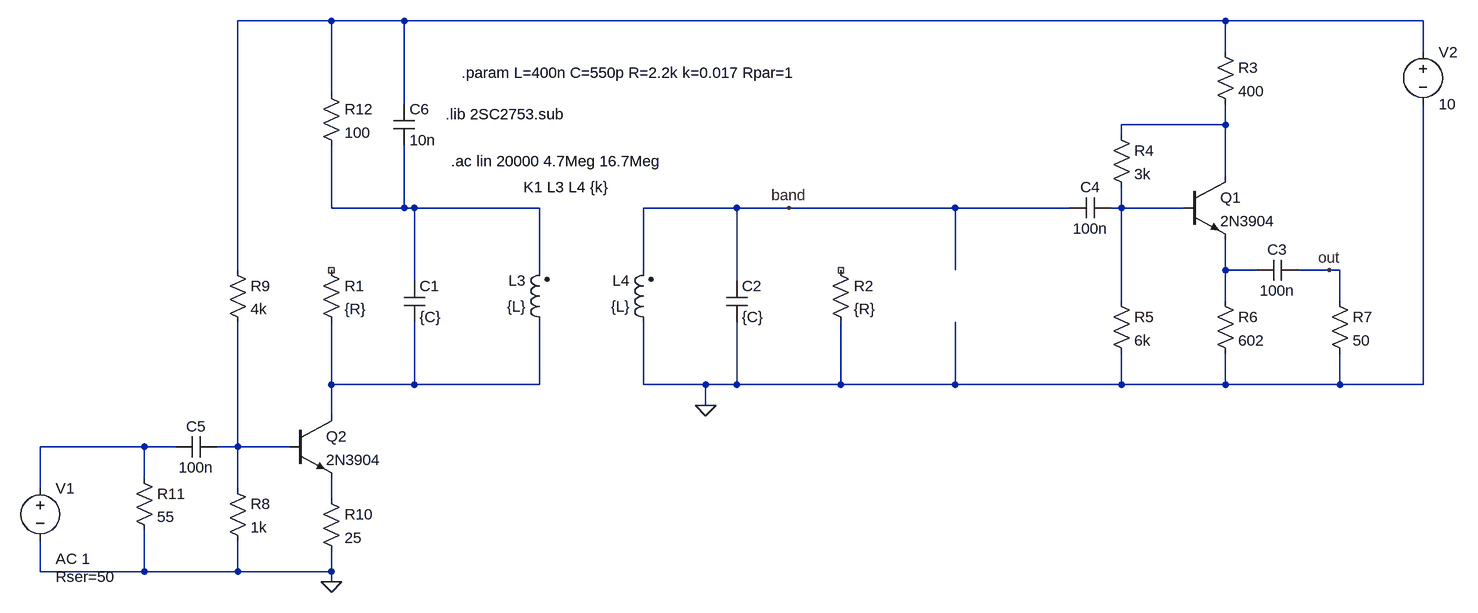
[diagram p0: schematic filter.asc]
filter.asc, the LTspice schematic file:
Version 4
SHEET 1 2424 760
WIRE 256 -176 112 -176
WIRE 368 -176 256 -176
WIRE 1632 -176 368 -176
WIRE 1936 -176 1632 -176
WIRE 1632 -128 1632 -176
WIRE 1936 -128 1936 -176
WIRE 256 -64 256 -176
WIRE 368 -48 368 -176
WIRE 1632 -16 1632 -48
WIRE 1632 -16 1472 -16
WIRE 1472 0 1472 -16
WIRE 1632 64 1632 -16
WIRE 256 112 256 16
WIRE 368 112 368 16
WIRE 368 112 256 112
WIRE 384 112 368 112
WIRE 576 112 384 112
WIRE 880 112 736 112
WIRE 960 112 880 112
WIRE 1216 112 960 112
WIRE 1392 112 1216 112
WIRE 1472 112 1472 80
WIRE 1472 112 1456 112
WIRE 1568 112 1472 112
WIRE 112 208 112 -176
WIRE 576 208 576 112
WIRE 736 208 736 112
WIRE 1216 208 1216 112
WIRE 1632 208 1632 160
WIRE 1680 208 1632 208
WIRE 1792 208 1744 208
WIRE 1808 208 1792 208
WIRE 384 224 384 112
WIRE 880 224 880 112
WIRE 1472 256 1472 112
WIRE 1632 256 1632 208
WIRE 1808 256 1808 208
WIRE 256 384 256 288
WIRE 384 384 384 288
WIRE 384 384 256 384
WIRE 576 384 576 288
WIRE 576 384 384 384
WIRE 736 384 736 288
WIRE 832 384 736 384
WIRE 880 384 880 288
WIRE 880 384 832 384
WIRE 1040 384 1040 288
WIRE 1040 384 880 384
WIRE 1216 384 1216 288
WIRE 1216 384 1040 384
WIRE 1472 384 1472 336
WIRE 1472 384 1216 384
WIRE 1632 384 1632 336
WIRE 1632 384 1472 384
WIRE 1808 384 1808 336
WIRE 1808 384 1632 384
WIRE 1936 384 1936 -48
WIRE 1936 384 1808 384
WIRE 832 416 832 384
WIRE 256 432 256 384
WIRE -32 480 -192 480
WIRE 16 480 -32 480
WIRE 112 480 112 288
WIRE 112 480 80 480
WIRE 192 480 112 480
WIRE -32 528 -32 480
WIRE -192 544 -192 480
WIRE 112 544 112 480
WIRE 256 560 256 528
WIRE -192 672 -192 624
WIRE -32 672 -32 608
WIRE -32 672 -192 672
WIRE 112 672 112 624
WIRE 112 672 -32 672
WIRE 256 672 256 640
WIRE 256 672 112 672
WIRE 256 688 256 672
FLAG 1792 208 out
FLAG 256 688 0
FLAG 832 416 0
FLAG 960 112 band
SYMBOL res 240 192 R0
SYMATTR InstName R1
SYMATTR Value {R}
SYMBOL cap 368 224 R0
SYMATTR InstName C1
SYMATTR Value {C}
SYMBOL cap 864 224 R0
SYMATTR InstName C2
SYMATTR Value {C}
SYMBOL res 1024 192 R0
SYMATTR InstName R2
SYMATTR Value {R}
SYMBOL ind2 592 304 R180
WINDOW 0 36 80 Left 2
WINDOW 3 36 40 Left 2
SYMATTR InstName L3
SYMATTR Value {L}
SYMATTR SpiceLine Rser=Rpar
SYMBOL ind2 752 304 R180
WINDOW 0 36 80 Left 2
WINDOW 3 36 40 Left 2
SYMATTR InstName L4
SYMATTR Value {L}
SYMATTR SpiceLine Rser=Rpar
SYMBOL npn 1568 64 R0
SYMATTR InstName Q1
SYMATTR Value 2N3904
SYMBOL res 1456 -16 R0
SYMATTR InstName R4
SYMATTR Value 3k
SYMBOL res 1456 240 R0
SYMATTR InstName R5
SYMATTR Value 6k
SYMBOL res 1616 240 R0
SYMATTR InstName R6
SYMATTR Value 602
SYMBOL voltage 1936 -144 R0
WINDOW 123 0 0 Left 0
WINDOW 39 0 0 Left 0
SYMATTR InstName V2
SYMATTR Value 10
SYMBOL cap 1744 192 R90
WINDOW 0 0 32 VBottom 2
WINDOW 3 32 32 VTop 2
SYMATTR InstName C3
SYMATTR Value 100n
SYMBOL res 1792 240 R0
SYMATTR InstName R7
SYMATTR Value 50
SYMBOL cap 1456 96 R90
WINDOW 0 0 32 VBottom 2
WINDOW 3 32 32 VTop 2
SYMATTR InstName C4
SYMATTR Value 100n
SYMBOL res 1616 -144 R0
SYMATTR InstName R3
SYMATTR Value 400
SYMBOL res 96 528 R0
SYMATTR InstName R8
SYMATTR Value 1k
SYMBOL res 96 192 R0
SYMATTR InstName R9
SYMATTR Value 4k
SYMBOL cap 80 464 R90
WINDOW 0 0 32 VBottom 2
WINDOW 3 32 32 VTop 2
SYMATTR InstName C5
SYMATTR Value 100n
SYMBOL res 240 544 R0
SYMATTR InstName R10
SYMATTR Value 25
SYMBOL voltage -192 528 R0
WINDOW 123 24 124 Left 2
WINDOW 39 24 152 Left 2
SYMATTR Value2 AC 1
SYMATTR SpiceLine Rser=50
SYMATTR InstName V1
SYMATTR Value ""
SYMBOL npn 192 432 R0
SYMATTR InstName Q2
SYMATTR Value 2N3904
SYMBOL res -48 512 R0
SYMATTR InstName R11
SYMATTR Value 55
SYMBOL res 240 -80 R0
SYMATTR InstName R12
SYMATTR Value 100
SYMBOL cap 352 -48 R0
SYMATTR InstName C6
SYMATTR Value 10n
TEXT 552 80 Left 2 !K1 L3 L4 {k}
TEXT 440 40 Left 2 !.ac lin 20000 4.7Meg 16.7Meg
TEXT 432 -32 Left 2 !.lib 2SC2753.sub
TEXT 456 -96 Left 2 !.param L=400n C=550p R=2.2k k=0.017 Rpar=1

The netlist it stands for:
* filter.asc
R1 NC_01 N006 {R}
C1 N003 N006 {C}
C2 band 0 {C}
R2 NC_02 0 {R}
L3 N006 N003 {L} Rser=Rpar
L4 0 band {L} Rser=Rpar
Q1 N002 N004 N005 0 2N3904
R4 N002 N004 3k
R5 N004 0 6k
R6 N005 0 602
V2 N001 0 10
C3 out N005 100n
R7 out 0 50
C4 N004 band 100n
R3 N001 N002 400
R8 N008 0 1k
R9 N001 N008 4k
C5 N008 N007 100n
R10 N009 0 25
V1 N007 0 AC 1 Rser=50
Q2 N006 N008 N009 0 2N3904
R11 N007 0 55
R12 N001 N003 100
C6 N001 N003 10n
.model NPN NPN
.model PNP PNP
.lib standard.bjt
K1 L3 L4 {k}
.ac lin 20000 4.7Meg 16.7Meg
.lib 2SC2753.sub
.param L=400n C=550p R=2.2k k=0.017 Rpar=1
.backanno
.end